# EasyEDA schematic Diplomski.json
TITLE: Sheet_1; REV: 2.0; Date: 2022-11-30; Sheet: 1/1; Drawn By: Boško Vasić; Company: Your Company
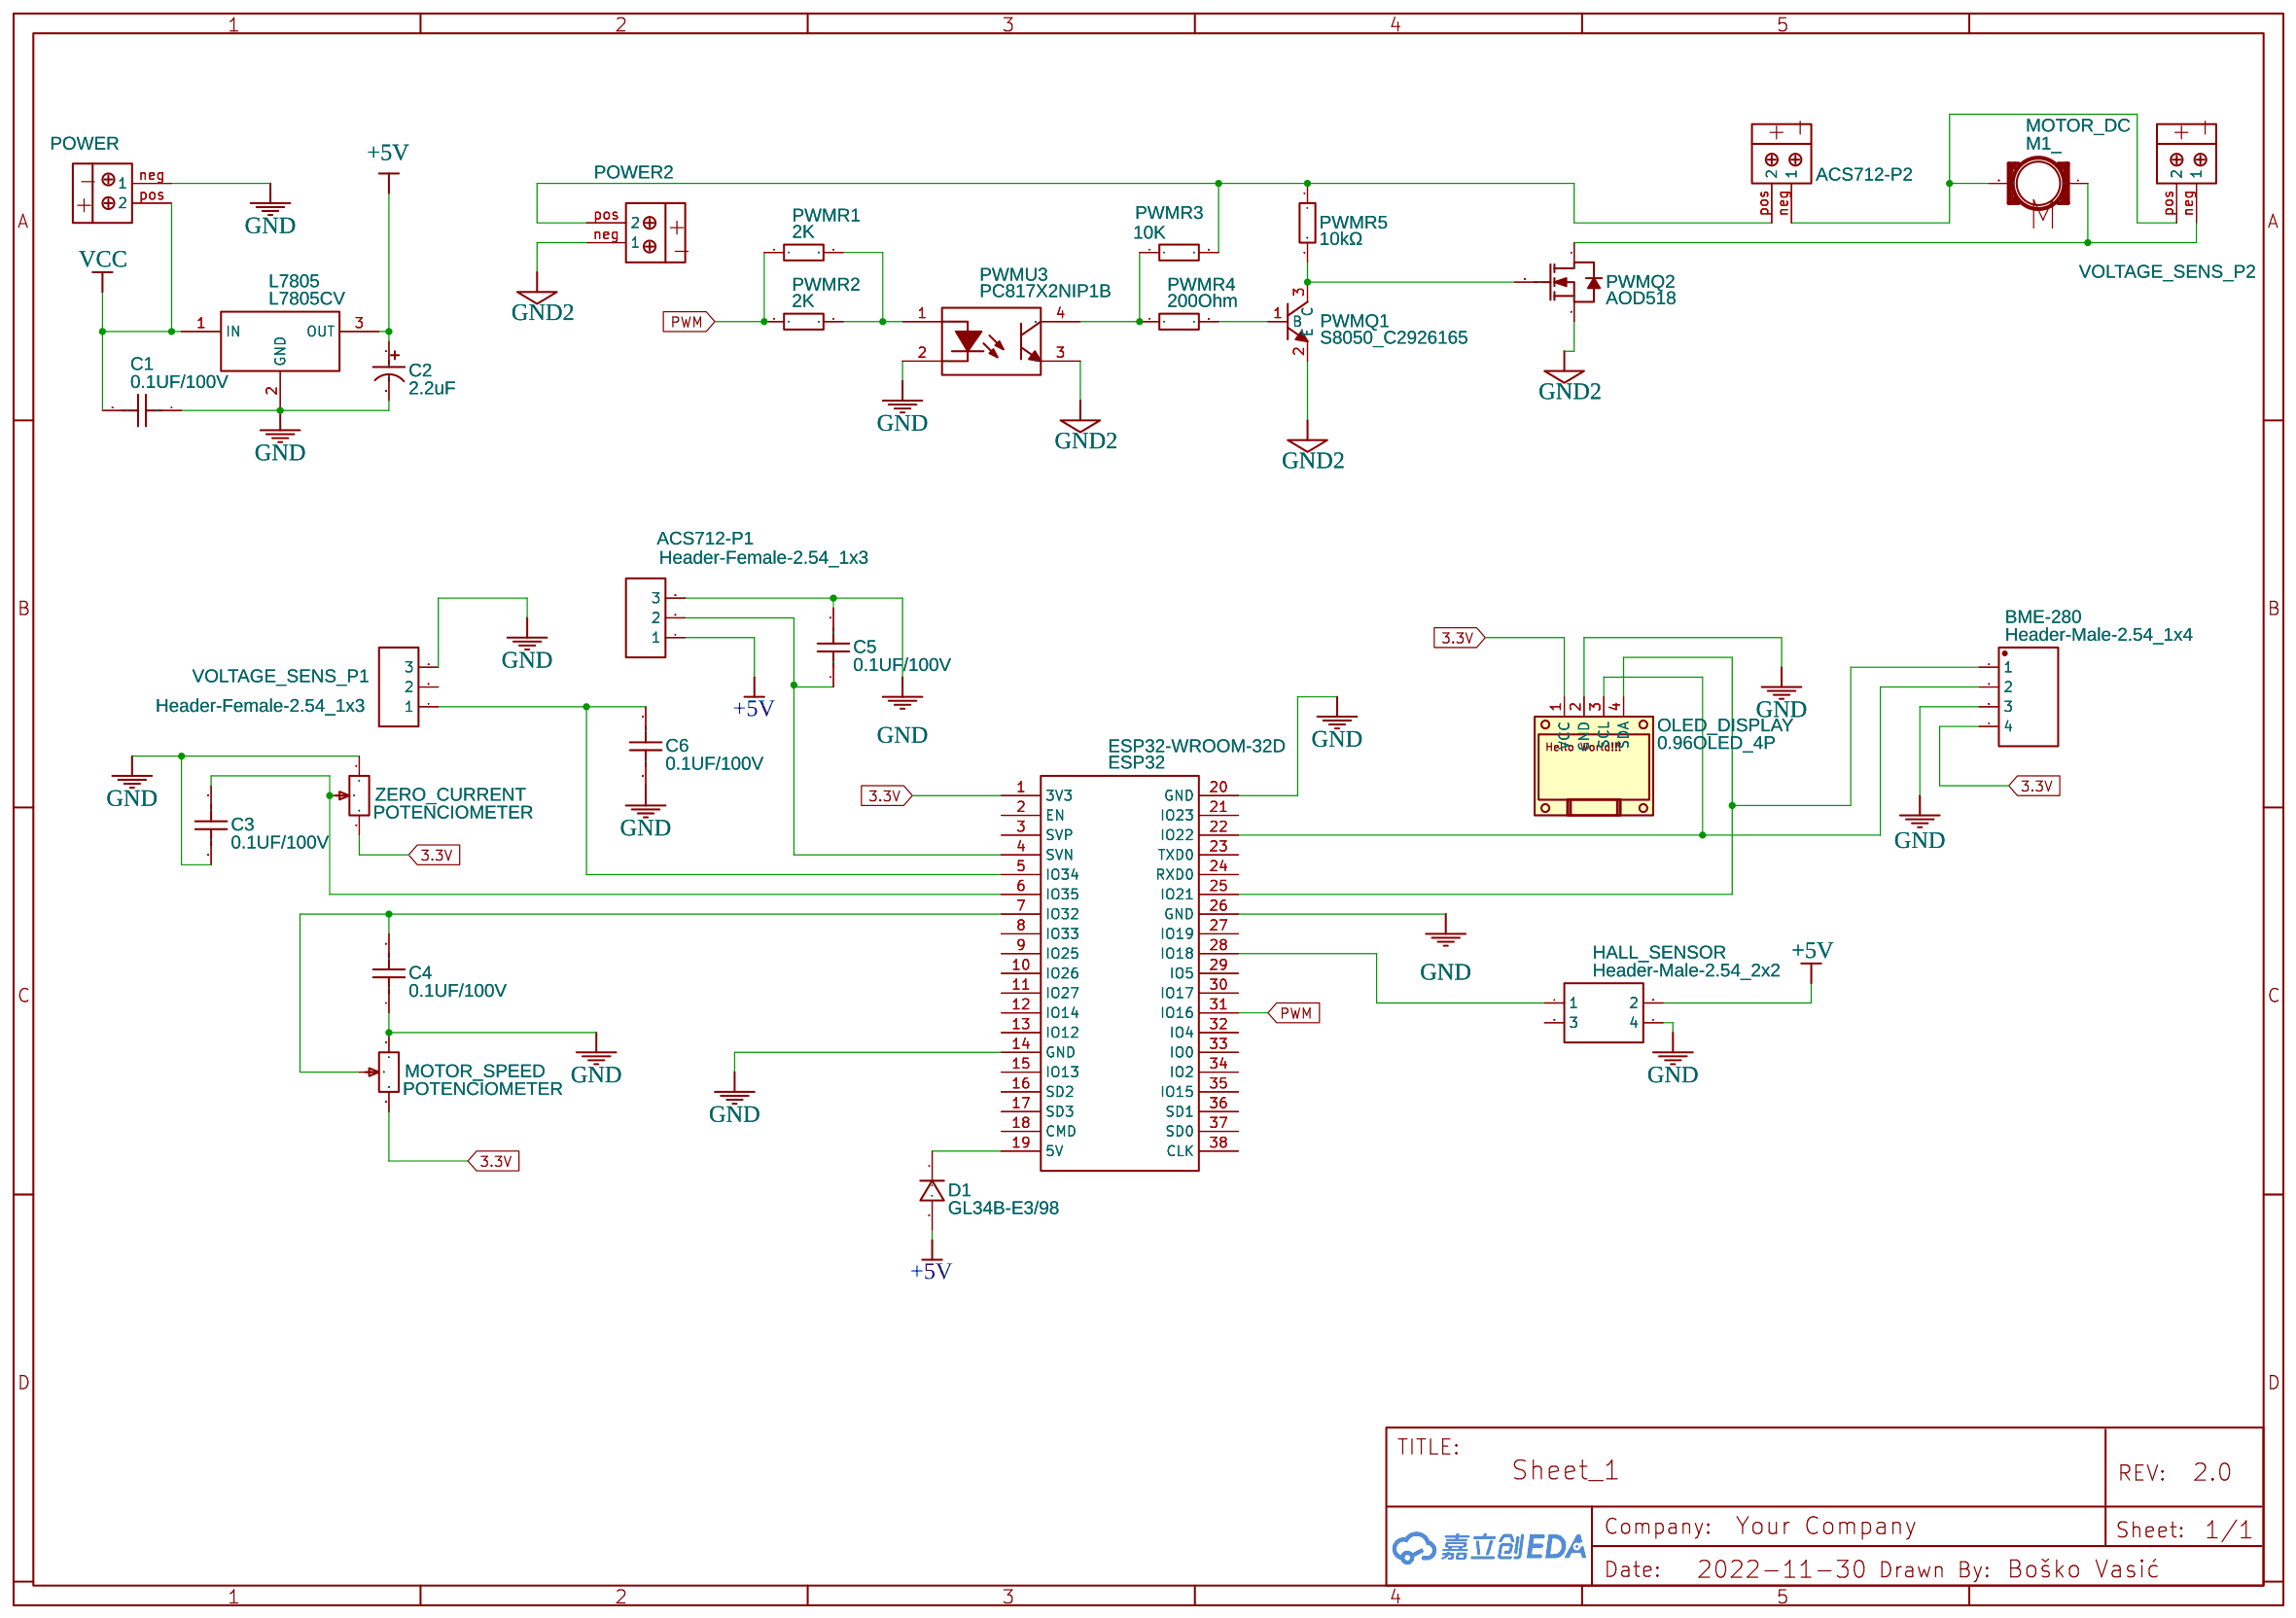
[diagram p0: schematic sheet]

## Parts
ACS712-P1  Header-Female-2.54_1x3  [HDR-TH_3P-P2.54-V-F]
ACS712-P2  1X2 POWER PCB CONNECTO COPY  [1X2-POWER-PCB-CONNECTOR]
BME-280  Header-Male-2.54_1x4  [HDR-TH_4P-P2.54-V-M]
C1  0.1UF/100V  [C0805]
C2  2.2uF  [2.2UF 50V]
C3  0.1UF/100V  [C0805]
C4  0.1UF/100V  [C0805]
C5  0.1UF/100V  [C0805]
C6  0.1UF/100V  [C0805]
D1  GL34B-E3/98  [DO-213AA_L3.5-W1.5-RD]
ESP32-WROOM-32D  ESP32  [ESP32-DEVKITC-32D]
HALL_SENSOR  Header-Male-2.54_2x2  [HDR-TH_4P-P2.54-V-M-R2-C2-S2.54-1]
L7805  L7805CV  [TO-220-3_L10.0-W4.5-P2.54-L]
MOTOR_DC  M1_  [MOTOR_DC]
MOTOR_SPEED  POTENCIOMETER  [ALPS_POT]
OLED_DISPLAY  0.96OLED_4P  [0.96OLED_4P]
POWER  1X2 POWER PCB CONNECTO COPY  [1X2-POWER-PCB-CONNECTOR]
POWER2  POWER PCB CONNECTO 2  [1X2-POWER-PCB-CONNECTOR]
PWMQ1  S8050_C2926165  [SOT-23-3_L2.9-W1.3-P1.90-LS2.4-BR]
PWMQ2  AOD518  [TO-252-2_L6.6-W6.1-P4.58-LS9.9-BR]
PWMR1  2K  [R1206]
PWMR2  2K  [R1206]
PWMR3  10K  [R0805]
PWMR4  200Ohm  [R0805]
PWMR5  10kΩ  [R0805]
PWMU3  PC817X2NIP1B  [OPTO-SMD-4_L4.6-W6.5-P2.54-LS10.3-TL]
VOLTAGE_SENS_P1  Header-Female-2.54_1x3  [HDR-TH_3P-P2.54-V-F]
VOLTAGE_SENS_P2  1X2 POWER PCB CONNECTO COPY  [1X2-POWER-PCB-CONNECTOR]
ZERO_CURRENT  POTENCIOMETER  [ALPS_POT]

## Library data of the parts
ACS712-P1 VOLTAGE_SENS_P1 = Header-Female-2.54_1x3: Supplier Part: C146243; Supplier: LCSC; Manufacturer: Boom Precision Elec; link: https://datasheet.lcsc.com/szlcsc/Boom-Precision-Elec-2-54mm-1-8P-Straight-Female-header_C27438.pdf; JLCPCB Part Class: Extended Part
ACS712-P2 POWER POWER2 VOLTAGE_SENS_P2 = 1X2 POWER PCB CONNECTO COPY: Manufacturer Part: 1x2 pin header; Contributor: Axbri
BME-280 = Header-Male-2.54_1x4: Supplier: LCSC; Manufacturer: Ckmtw(灿科盟); Manufacturer Part: B-2100S04P-A110; Contributor: LCSC; Supplier Part: C124378; JLCPCB Part Class: Extended Part
C1 C3-C6 = 0.1UF/100V: Supplier: LCSC; Supplier Part: C9900010259; Manufacturer: null; Manufacturer Part: 0.1uF/100V; Contributor: LCSC; JLCPCB Part Class: Extended Part
C2 = 2.2UF 50V: Manufacturer: AISHI; Manufacturer Part: ERM1HM2R2D11OT; Supplier Part: C106603; Contributor: PratikPatel
D1 = GL34B-E3/98: Supplier: LCSC; Supplier Part: C222497; Manufacturer: VISHAY(威世); Contributor: LCSC; JLCPCB Part Class: Extended Part
ESP32-WROOM-32D = Boiler: Manufacturer: ESPRESSIF; Supplier: TME; link: https://www.tme.eu/pl/details/esp32-devkitc-32d/zestawy-do-transmisji-danych/espressif/; Contributor: citakis
HALL_SENSOR = Header-Male-2.54_2x2: Supplier: LCSC; Manufacturer: BOOMELE; Manufacturer Part: Double Rows2.54mm2*2pHeaders  Pins; Supplier Part: C66690; JLCPCB Part Class: Extended Part
L7805 = L7805CV: Supplier: LCSC; Manufacturer: ST(意法半导体); Supplier Part: C111887; JLCPCB Part Class: Extended Part
MOTOR_DC = Motor_DC
MOTOR_SPEED ZERO_CURRENT = POTENCIOMETER: Manufacturer Part: APAE_B10K_Potentiometer_Vertical; Contributor: Jaroslav Sikl
OLED_DISPLAY = 0.96OLED_4P: Contributor: LCEDA_Lib
PWMQ1 = S8050_C2926165: Supplier: LCSC; Supplier Part: C2926165; Manufacturer: FOSAN(富信); Manufacturer Part: S8050LT1 J3Y; Contributor: LCSC; JLCPCB Part Class: Extended Part
PWMQ2 = AOD518: Supplier: LCSC; Supplier Part: C878924; Manufacturer: VBsemi(微碧); Contributor: LCSC; JLCPCB Part Class: Extended Part
PWMR1 PWMR2 = RC1206FR-070RL: Supplier: LCSC; Manufacturer: YAGEO; Supplier Part: C137394; JLCPCB Part Class: Extended Part; Resistance: 0Ω
PWMR3 PWMR4 = AC0805FR-0710KL: Supplier: LCSC; Manufacturer: YAGEO; Contributor: LCSC; Supplier Part: C140868; JLCPCB Part Class: Extended Part; Resistance: 10kΩ
PWMR5 = ARG05FTC2000: Supplier: LCSC; Supplier Part: C218416; Manufacturer: Viking Tech; Resistance (Ohms): 200; Contributor: LCSC; JLCPCB Part Class: Extended Part
PWMU3 = PC817X2NIP1B: Supplier: LCSC; Manufacturer: SHARP; Contributor: LCSC; Supplier Part: C164149; JLCPCB Part Class: Extended Part

## Nets
3.3V: BME-280.4 ESP32-WROOM-32D.1(3V3) MOTOR_SPEED.3 OLED_DISPLAY.1(VCC) ZERO_CURRENT.3
+5V: ACS712-P1.1 C2.1 D1.2 HALL_SENSOR.2 L7805.3(OUT)
GND: ACS712-P1.3 BME-280.3 C1.1 C2.2 C3.1 C4.1 C5.2 C6.1 ESP32-WROOM-32D.14(GND) ESP32-WROOM-32D.20(GND) ESP32-WROOM-32D.26(GND) HALL_SENSOR.4 L7805.2(GND) MOTOR_SPEED.1 OLED_DISPLAY.2(GND) POWER.neg(1) PWMU3.2(CA) VOLTAGE_SENS_P1.3 ZERO_CURRENT.1
GND2: POWER2.neg(1) PWMQ1.2(E) PWMQ2.3(S) PWMU3.3(EM)
VCC: C1.2 L7805.1(IN) POWER.pos(2)
PWM: ESP32-WROOM-32D.31(IO16) PWMR1.1 PWMR2.1
Net-(ACS712-P1-2): ACS712-P1.2 C5.1 ESP32-WROOM-32D.4(SVN)
Net-(ACS712-P2-neg): ACS712-P2.neg(1) MOTOR_DC.2 VOLTAGE_SENS_P2.pos(2)
Net-(ACS712-P2-pos): ACS712-P2.pos(2) POWER2.pos(2) PWMR3.2 PWMR5.1
Net-(BME-280-1): BME-280.1 ESP32-WROOM-32D.25(IO21) OLED_DISPLAY.4(SDA)
Net-(BME-280-2): BME-280.2 ESP32-WROOM-32D.22(IO22) OLED_DISPLAY.3(SCL)
Net-(C3-2): C3.2 ESP32-WROOM-32D.6(IO35) ZERO_CURRENT.2
Net-(C4-2): C4.2 ESP32-WROOM-32D.7(IO32) MOTOR_SPEED.2
Net-(C6-2): C6.2 ESP32-WROOM-32D.5(IO34) VOLTAGE_SENS_P1.1
Net-(D1-1): D1.1 ESP32-WROOM-32D.19(5V)
Net-(ESP32-WROOM-32D-28): ESP32-WROOM-32D.28(IO18) HALL_SENSOR.1
Net-(MOTOR_DC-1): MOTOR_DC.1 PWMQ2.2(D) VOLTAGE_SENS_P2.neg(1)
Net-(PWMQ1-1): PWMQ1.1(B) PWMR4.2
Net-(PWMQ1-3): PWMQ1.3(C) PWMQ2.1(G) PWMR5.2
Net-(PWMR1-2): PWMR1.2 PWMR2.2 PWMU3.1(AN)
Net-(PWMR3-1): PWMR3.1 PWMR4.1 PWMU3.4(COL)

Not connected (* = marked no-connect by the designer): ESP32-WROOM-32D 2(EN) 3(SVP) 8(IO33) 9(IO25) 10(IO26) 11(IO27) 12(IO14) 13(IO12) 15(IO13) 16(SD2) 17(SD3) 18(CMD) 21(IO23) 23(TXD0) 24(RXD0) 27(IO19) 29(IO5) 30(IO17) 32(IO4) 33(IO0) 34(IO2) 35(IO15) 36(SD1) 37(SD0) 38(CLK); HALL_SENSOR 3; VOLTAGE_SENS_P1 2
